# Altium schematic sheet parent_altium-designer.schdoc
size 252 x 219 mm
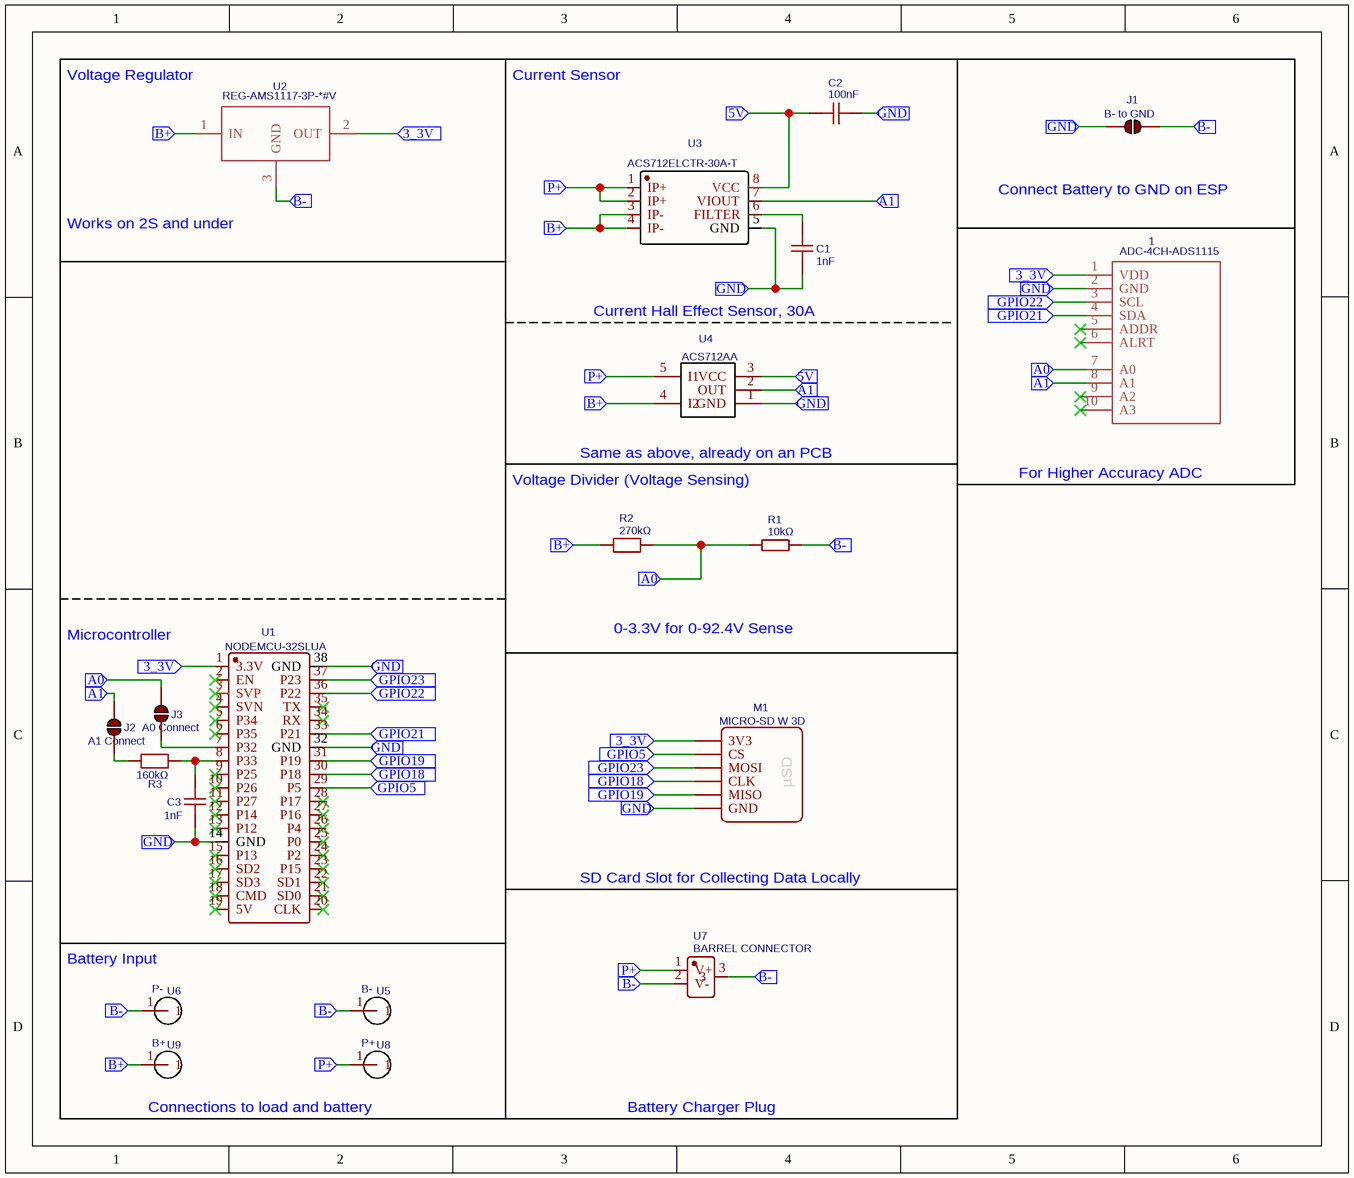
[diagram p0: parent_altium-designer.schdoc]

## Parts
1  ADC-4CH-ADS1115  [ADC-4CH-ADS1115]
C1  1nF  [CAP-TH_L5.5-W4.0-P5.00-D0.5]
C2  100nF  [CAP-TH_L5.0-W2.5-P2.54-D0.7]
C3  1nF  [CAP-TH_L5.5-W4.0-P5.00-D0.5]
J1  B- to GND  [SOLDERJUMPERSMALL]
J2  A1 Connect  [SOLDERJUMPERSMALL]
J3  A0 Connect  [SOLDERJUMPERSMALL]
M1  MICRO-SD W 3D  [MICRO-SD-MODULE]
R1  10kΩ  [RES-TH_BD2.2-L6.5-P10.50-D0.6]
R2  270kΩ  [RES-TH_BD2.4-L6.3-P10.30-D0.6]
R3  160kΩ  [RES-TH_BD2.4-L6.3-P10.30-D0.6]
U1  NODEMCU-32SLUA  [COMM-TH_NODEMCU-32SLUA]
U2  REG-AMS1117-3P-*#V  [REG-AMS1117-3P#V]
U3  ACS712ELCTR-30A-T  [SOIC-8_L5.0-W4.0-P1.27-LS6.0-BL]
U4  ACS712AA  [ACS712]
U5  B-  [22-GAUGE]
U6  P-  [22-GAUGE]
U7  BARREL CONNECTOR  [BARREL CONNECTOR]
U8  P+  [22-GAUGE]
U9  B+  [22-GAUGE]

## Blocks framed on the sheet
Connect Battery to GND on ESP: J1
For Higher Accuracy ADC: 1
Microcontroller: C3 J2 J3 R3 U1

## Ports
3_3V (in), 5V (in), A0 (in), A1 (in), B+ (in), B- (in), GND (in), GPIO5 (in), GPIO18 (in), GPIO19 (in), GPIO21 (in), GPIO22 (in), GPIO23 (in), P+ (in)

## Nets
3_3V: 1.1(VDD) M1.1(3V3) U1.1(3.3V) U2.2(OUT) ; port 3_3V
5V: C2.2 U3.8(VCC) U4.3(VCC) ; port 5V
A0: 1.7(A0) J3.1 R1.1 R2.1 ; port A0
A1: 1.8(A1) J2.1 U3.7(VIOUT) U4.2(OUT) ; port A1
B+: R2.2 U2.1(IN) U3.3(IP-) U3.4(IP-) U4.4(I2) U9.1 ; port B+
B-: J1.2 R1.2 U2.3(GND) U5.1 U6.1 U7.2(V-) U7.3 ; port B-
GND: 1.2(GND) C1.2 C2.1 C3.2 J1.1 M1.6(GND) U1.14(GND) U1.32(GND) U1.38(GND) U3.5(GND) U4.1(GND) ; port GND
GPIO5: M1.2(CS) U1.29(P5) ; port GPIO5
GPIO18: M1.4(CLK) U1.30(P18) ; port GPIO18
GPIO19: M1.5(MISO) U1.31(P19) ; port GPIO19
GPIO21: 1.4(SDA) U1.33(P21) ; port GPIO21
GPIO22: 1.3(SCL) U1.36(P22) ; port GPIO22
GPIO23: M1.3(MOSI) U1.37(P23) ; port GPIO23
P+: U3.1(IP+) U3.2(IP+) U4.5(I1) U7.1(V+) U8.1 ; port P+
NetC1_1: C1.1 U3.6(FILTER)
NetC3_1: C3.1 R3.2 U1.8(P33)
NetJ2_2: J2.2 R3.1
NetJ3_2: J3.2 U1.7(P32)

Not connected (* = marked no-connect by the designer): 1 5(ADDR)* 6(ALRT)* 9(A2)* 10(A3)*; U1 2(EN)* 3(SVP)* 4(SVN)* 5(P34)* 6(P35)* 9(P25)* 10(P26)* 11(P27)* 12(P14)* 13(P12)* 15(P13)* 16(SD2)* 17(SD3)* 18(CMD)* 19(5V)* 20(CLK)* 21(SD0)* 22(SD1)* 23(P15)* 24(P2)* 25(P0)* 26(P4)* 27(P16)* 28(P17)* 34(RX)* 35(TX)*

## Notes on the sheet
- Voltage Regulator
- Current Sensor
- Works on 2S and under
- Current Hall Effect Sensor, 30A
- (near U4) Same as above, already on an PCB
- Voltage Divider (Voltage Sensing)
- 0-3.3V for 0-92.4V Sense
- SD Card Slot for Collecting Data Locally
- (near U6) Battery Input
- Connections to load and battery
- Battery Charger Plug
- (in symbol MICRO-SD W 3D) µSD

## Library data of the parts
1 = ADC-4CH-ADS1115: Contributor: Tim Neuber; spicePre: ?; spiceSymbolName: ADC-4CH-ADS1115
C1 C3 = 1nF: Manufacturer: KNSCHA(科尼盛); Manufacturer Part: Y5P102K2KV16CC0224; nameAlias: Value; Contributor: LCSC; Supplier: LCSC; Supplier Part: C2887266; JLCPCB Part Class: Extended Part; link: https://lcsc.com/eda_search?q=C2887266&%26type=1&ref=editor; spicePre: C; spiceSymbolName: Y5P102K2KV16CC0224
C2 = 100nF: Manufacturer: Dersonic(德尔创); Manufacturer Part: CC1H104ZA1PD3F5O30MF; nameAlias: Value; Contributor: LCSC; Supplier: LCSC; Supplier Part: C254067; JLCPCB Part Class: Extended Part; link: https://lcsc.com/eda_search?q=C254067&%26type=1&ref=editor; spicePre: C; spiceSymbolName: CC1H104ZA1PD3F5O30MF
J1 = B- to GND: Contributor: stefan.klaeui; spicePre: J; spiceSymbolName: SOLDERJUMPERSMALL
J2 = A1 Connect: Contributor: stefan.klaeui; spicePre: J; spiceSymbolName: SOLDERJUMPERSMALL
J3 = A0 Connect: Contributor: stefan.klaeui; spicePre: J; spiceSymbolName: SOLDERJUMPERSMALL
M1 = MICRO-SD W 3D: sourceId: n1LFXQ8qk; Contributor: smurferman; timeStamp: 1474159749; spicePre: M; spiceSymbolName: MICRO-SD W 3D
R1 = 10kΩ: Manufacturer: YAGEO(国巨); Manufacturer Part: MFR-25FTE52-100K; nameAlias: Value; Contributor: LCSC; Supplier: LCSC; Supplier Part: C172965; JLCPCB Part Class: Extended Part; link: https://lcsc.com/eda_search?q=C172965&%26type=1&ref=editor; spicePre: R; spiceSymbolName: MFR-25FTE52-100K
R2 = 270kΩ: Manufacturer: YAGEO(国巨); Manufacturer Part: CFR-25JR-52-270K; Contributor: lcsc; nameAlias: Value; Supplier: LCSC; Supplier Part: C723609; JLCPCB Part Class: Extended Part; link: https://lcsc.com/eda_search?q=C723609&%26type=1&ref=editor; spicePre: U; spiceSymbolName: CFR-25JR-52-270K
R3 = 160kΩ: Manufacturer: YAGEO(国巨); Manufacturer Part: CFR-25JR-52-270K; Contributor: lcsc; nameAlias: Value; Supplier: LCSC; Supplier Part: C723609; JLCPCB Part Class: Extended Part; link: https://lcsc.com/eda_search?q=C723609&%26type=1&ref=editor; spicePre: U; spiceSymbolName: CFR-25JR-52-270K
U1 = NODEMCU-32SLUA: Manufacturer: Ai-Thinker(安信可); Contributor: lcsc; Supplier: LCSC; Supplier Part: C111436; Manufacturer Part: NodeMCU-32SLua; JLCPCB Part Class: Extended Part; link: https://lcsc.com/eda_search?q=C111436&%26type=1&ref=editor; spicePre: U; spiceSymbolName: NODEMCU-32SLUA
U2 = REG-AMS1117-3P-*#V: Contributor: jboutin; spicePre: ?; spiceSymbolName: REG-AMS1117-3P-*#V
U3 = ACS712ELCTR-30A-T: Manufacturer: ALLEGRO(美国埃戈罗); Supplier: LCSC; Manufacturer Part: ACS712ELCTR-30A-T; Supplier Part: C9932; JLCPCB Part Class: Extended Part; link: https://lcsc.com/eda_search?q=C9932&%26type=1&ref=editor; spicePre: U; spiceSymbolName: ACS712ELCTR-30A-T
U4 = ACS712AA: Contributor: Ronald Rezal; spicePre: U; spiceSymbolName: ACS712AA
U5 = B-: Contributor: GORILLA-LINK; spicePre: U; spiceSymbolName: 13-GAUGE
U6 = P-: Contributor: GORILLA-LINK; spicePre: U; spiceSymbolName: 13-GAUGE
U7 = BARREL CONNECTOR: Contributor: scthornquist; spicePre: U; spiceSymbolName: BARREL CONNECTOR
U8 = P+: Contributor: GORILLA-LINK; spicePre: U; spiceSymbolName: 13-GAUGE
U9 = B+: Contributor: GORILLA-LINK; spicePre: U; spiceSymbolName: 13-GAUGE